# EAGLE design isd main lighting board-v2 (EAGLE 9.6.2)
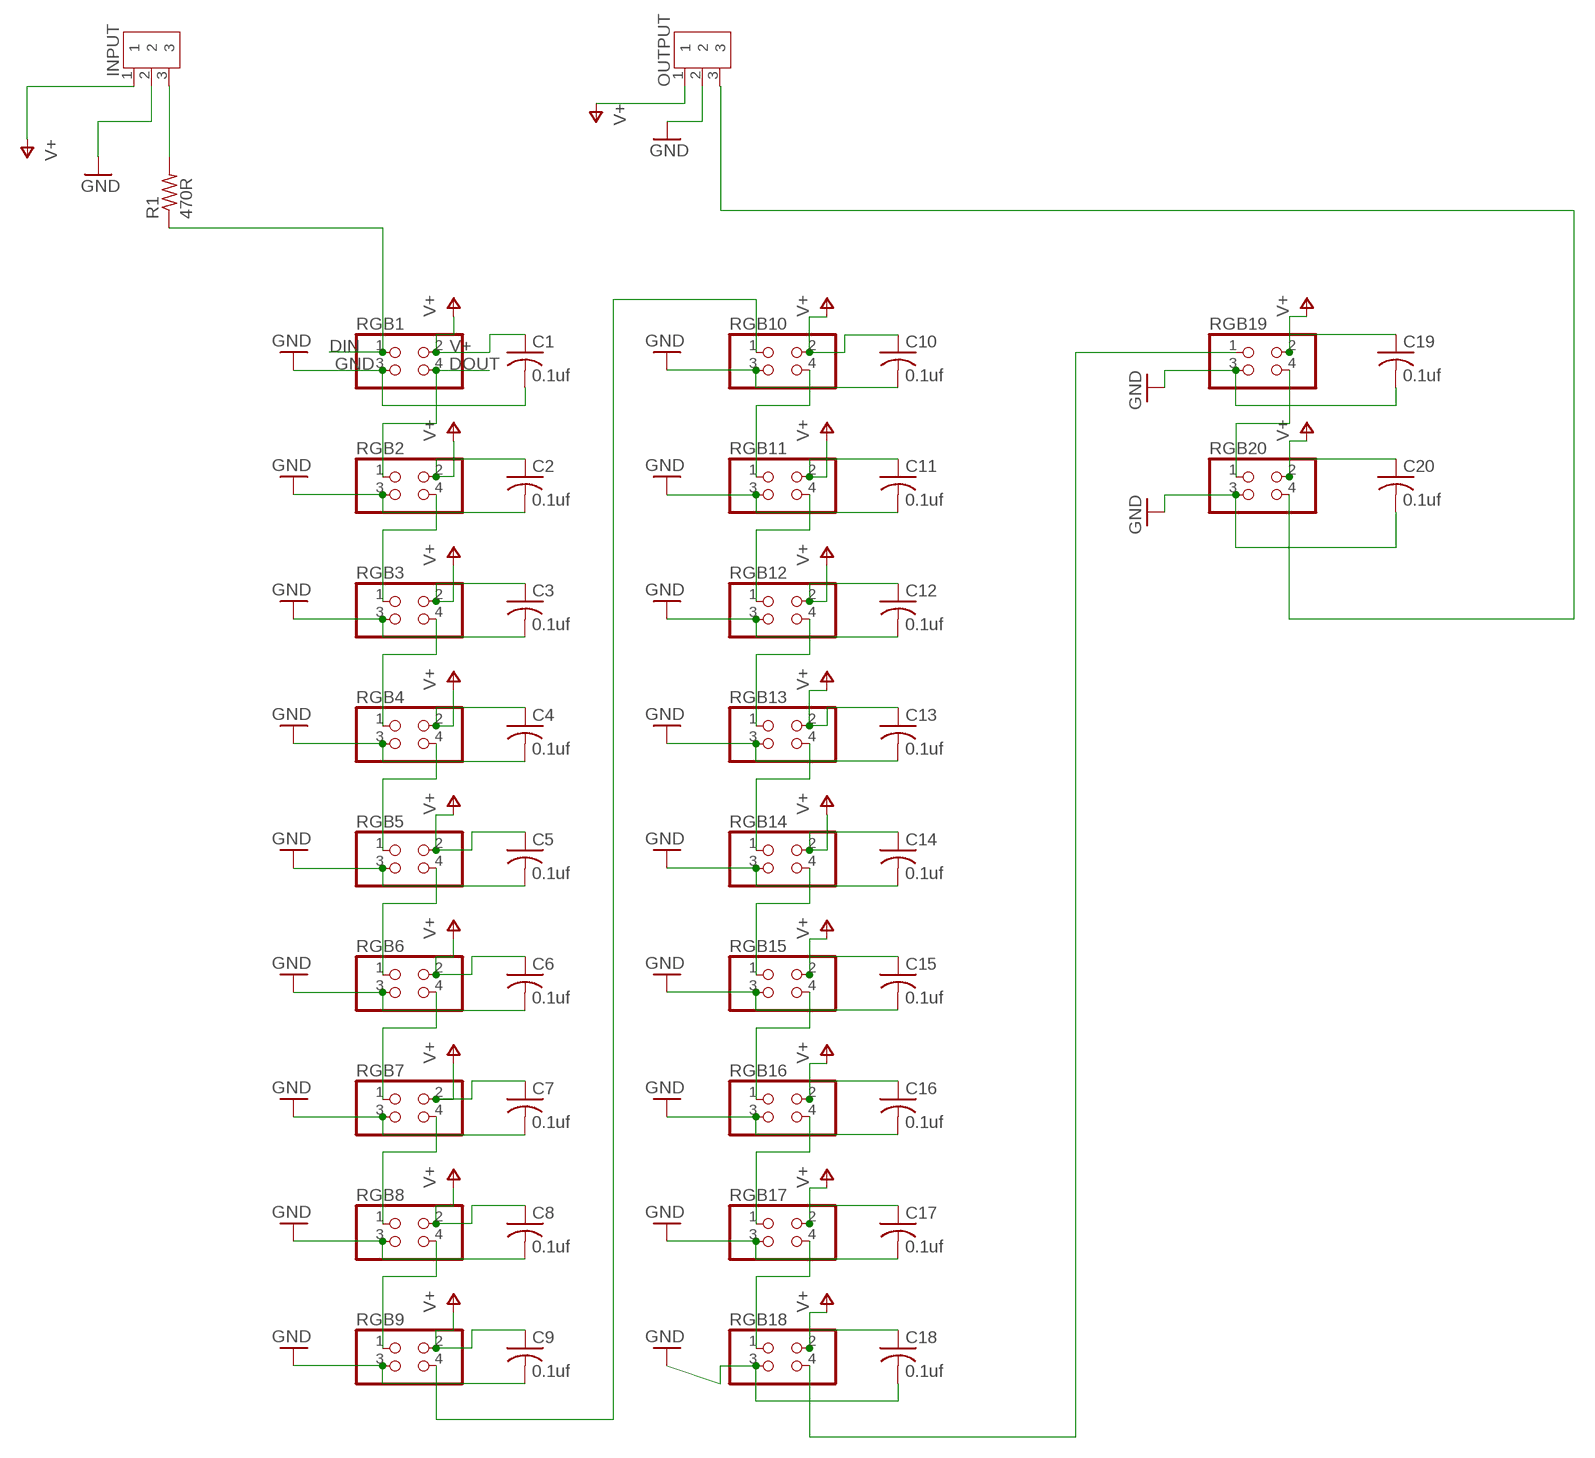
[diagram p0: schematic, sheet 1]

## Parts
C1  0.1uf  C-USC0805  [C0805]
C2  0.1uf  C-USC0805  [C0805]
C3  0.1uf  C-USC0805  [C0805]
C4  0.1uf  C-USC0805  [C0805]
C5  0.1uf  C-USC0805  [C0805]
C6  0.1uf  C-USC0805  [C0805]
C7  0.1uf  C-USC0805  [C0805]
C8  0.1uf  C-USC0805  [C0805]
C9  0.1uf  C-USC0805  [C0805]
C10  0.1uf  C-USC0805  [C0805]
C11  0.1uf  C-USC0805  [C0805]
C12  0.1uf  C-USC0805  [C0805]
C13  0.1uf  C-USC0805  [C0805]
C14  0.1uf  C-USC0805  [C0805]
C15  0.1uf  C-USC0805  [C0805]
C16  0.1uf  C-USC0805  [C0805]
C17  0.1uf  C-USC0805  [C0805]
C18  0.1uf  C-USC0805  [C0805]
C19  0.1uf  C-USC0805  [C0805]
C20  0.1uf  C-USC0805  [C0805]
INPUT  B3B-XH-A  [B3B-XH-A]
OUTPUT  B3B-XH-A  [B3B-XH-A]
R1  470R  R-US_0204/5  [0204/5]
RGB1  PINHD-2X2  [2X02]
RGB2  PINHD-2X2  [2X02]
RGB3  PINHD-2X2  [2X02]
RGB4  PINHD-2X2  [2X02]
RGB5  PINHD-2X2  [2X02]
RGB6  PINHD-2X2  [2X02]
RGB7  PINHD-2X2  [2X02]
RGB8  PINHD-2X2  [2X02]
RGB9  PINHD-2X2  [2X02]
RGB10  PINHD-2X2  [2X02]
RGB11  PINHD-2X2  [2X02]
RGB12  PINHD-2X2  [2X02]
RGB13  PINHD-2X2  [2X02]
RGB14  PINHD-2X2  [2X02]
RGB15  PINHD-2X2  [2X02]
RGB16  PINHD-2X2  [2X02]
RGB17  PINHD-2X2  [2X02]
RGB18  PINHD-2X2  [2X02]
RGB19  PINHD-2X2  [2X02]
RGB20  PINHD-2X2  [2X02]

## Nets
DIN: R1.1 RGB1.1
DOUT: RGB1.4 RGB2.1
GND: C1.2 C2.2 C3.2 C4.2 C5.2 C6.2 C7.2 C8.2 C9.2 C10.2 C11.2 C12.2 C13.2 C14.2 C15.2 C16.2 C17.2 C18.2 C19.2 C20.2 INPUT.2 OUTPUT.2 RGB1.3 RGB2.3 RGB3.3 RGB4.3 RGB5.3 RGB6.3 RGB7.3 RGB8.3 RGB9.3 RGB10.3 RGB11.3 RGB12.3 RGB13.3 RGB14.3 RGB15.3 RGB16.3 RGB17.3 RGB18.3 RGB19.3 RGB20.3
N$1: INPUT.3 R1.2
N$2: OUTPUT.3 RGB20.4
N$3: RGB18.4 RGB19.1
N$4: RGB8.4 RGB9.1
N$6: RGB16.4 RGB17.1
N$7: RGB19.4 RGB20.1
N$8: RGB15.4 RGB16.1
N$10: RGB14.4 RGB15.1
N$11: RGB17.4 RGB18.1
N$12: RGB13.4 RGB14.1
N$14: RGB12.4 RGB13.1
N$17: RGB11.4 RGB12.1
N$19: RGB10.4 RGB11.1
N$24: RGB9.4 RGB10.1
N$27: RGB7.4 RGB8.1
N$29: RGB6.4 RGB7.1
N$31: RGB5.4 RGB6.1
N$33: RGB4.4 RGB5.1
N$36: RGB3.4 RGB4.1
N$39: RGB2.4 RGB3.1
V+: C1.1 C2.1 C3.1 C4.1 C5.1 C6.1 C7.1 C8.1 C9.1 C10.1 C11.1 C12.1 C13.1 C14.1 C15.1 C16.1 C17.1 C18.1 C19.1 C20.1 INPUT.1 OUTPUT.1 RGB1.2 RGB2.2 RGB3.2 RGB4.2 RGB5.2 RGB6.2 RGB7.2 RGB8.2 RGB9.2 RGB10.2 RGB11.2 RGB12.2 RGB13.2 RGB14.2 RGB15.2 RGB16.2 RGB17.2 RGB18.2 RGB19.2 RGB20.2

## Library data of the parts
C1-C20 = adafruit:C-US: CAPACITOR, American symbol
INPUT OUTPUT = Connector:B3B-XH-A: XH Connector Top Entry - 3POS Details see: Datasheet <http://www.jst-mfg.com/product/pdf/eng/eXH.pdf>; CATEGORY: CONNECTOR; DESCRIPTION: 2.5mm pitch/disconnectable crimp style connector; MANUFACTURER: JST (XH connector); MPN: B3B-XH-A; PART_STATUS: ACTIVE; ROHS_COMPLIANT: COMPLIANT; SERIES: B3B-XH-A; SUB_CATEGORY: THROUGH HOLE CONNECTOR; TYPE: SIDE ENTRY; VALUE: 3A/250V
R1 = adafruit:R-US_: RESISTOR, American symbol
RGB1-RGB20 = pinhead:PINHD-2X2: PIN HEADER

## Net classes
0 default: clearance 0.205 mm

## Board
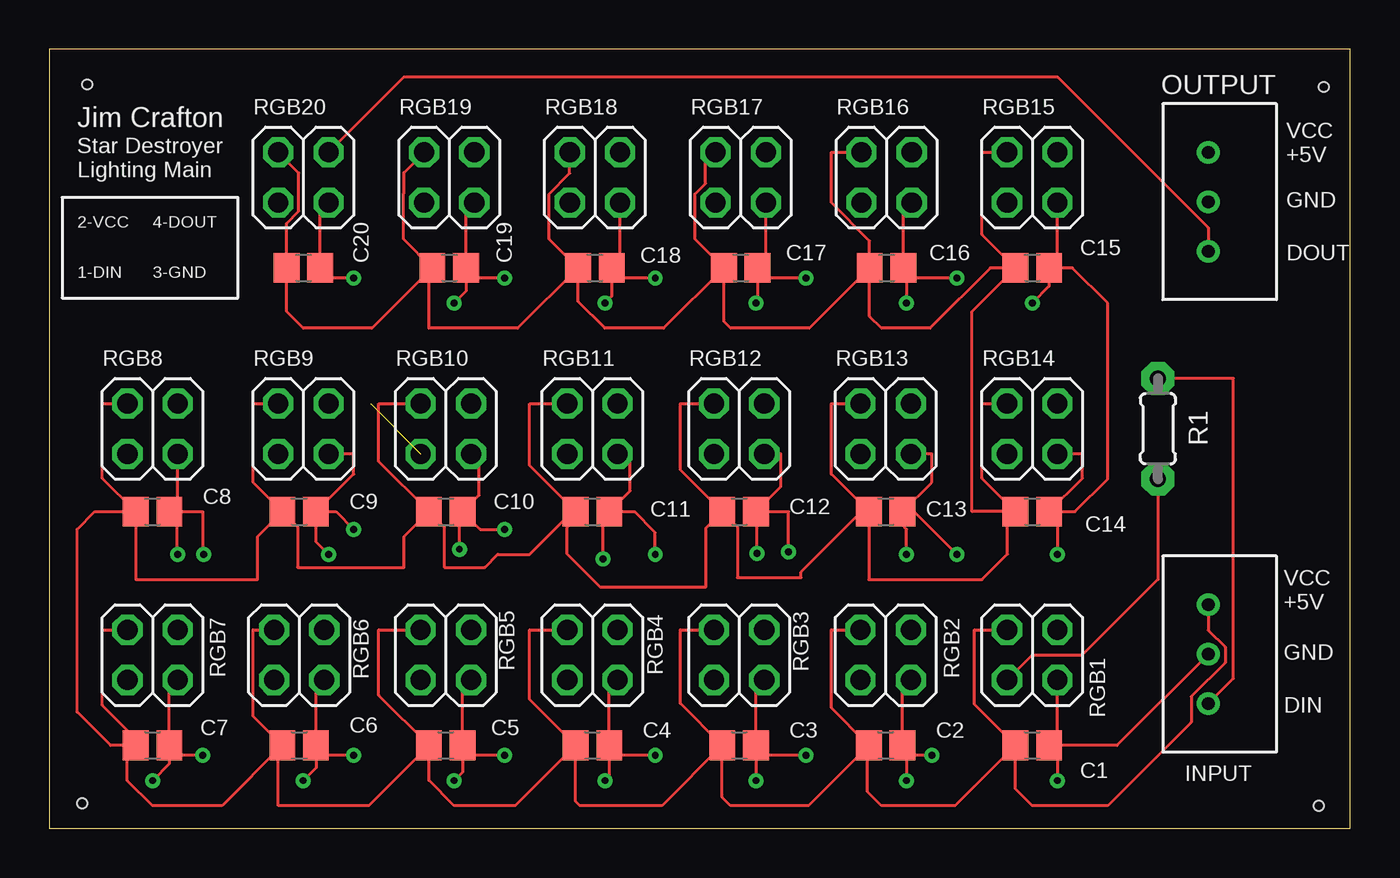
[diagram p1: board, top side]
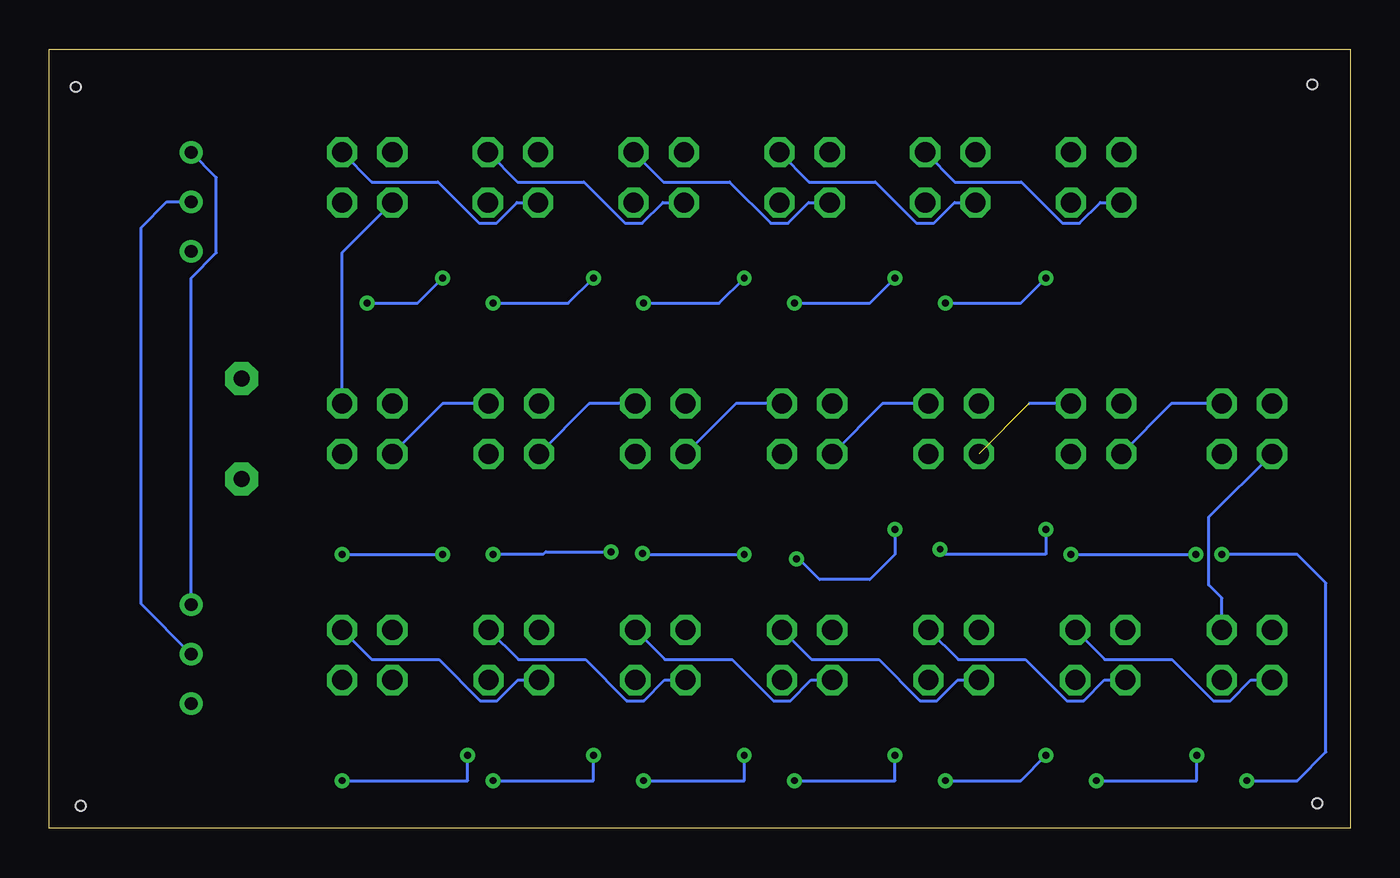
[diagram p2: board, bottom side, seen from below]

Size 65.71 x 39.36 mm. Coordinates in mm from the lower left corner, seen from the top.
Outline: 0,0 65.71,0 65.71,39.36 0,39.36 0,0
Copper layers (1*16): Top 0.035mm / dielectric 1.5mm / Bottom 0.035mm
Design rules "default": minimum track width 6mil, minimum drill 0.35mm, track to track 6mil, track to pad 6mil, pad to pad 6mil, via to via 6mil, smd to smd 6mil, copper to edge 40mil, drill to drill 6mil, minimum pad ring 10mil, minimum via ring 8mil, stop-mask expansion 4mil, vias tented up to drill 0mil, thermal gap 10mil
Holes 0.5 mm at 1.91,37.59 1.65,1.27 64.39,37.47 64.14,1.14

### Footprints (pad centres in the part's own frame; a part is rotated, then mirrored left to right if it is on the bottom)
C0805 = smd 1.3 x 1.5: 1 -0.85,0; 2 0.85,0
B3B-XH-A = drill 0.64: 1 0,0; 2 2.5,0; 3 5,0
0204/5 = drill 0.813 pad 1.676 octagon: 1 -2.54,0; 2 2.54,0
2X02 = drill 1.016 octagon: 1 -1.27,-1.27; 2 -1.27,1.27; 3 1.27,-1.27; 4 1.27,1.27

### Placement (x,y rotation side)
C1  49.66,4.19 0 top
C2  42.25,4.19 0 top
C3  34.84,4.19 0 top
C4  27.43,4.19 0 top
C5  20.02,4.19 0 top
C6  12.62,4.19 0 top
C7  5.21,4.19 0 top
C8  5.21,16 0 top
C9  12.62,16 0 top
C10  20.02,16 0 top
C11  27.43,16 0 top
C12  34.84,16 0 top
C13  42.25,16 0 top
C14  49.66,16 0 top
C15  49.66,28.32 0 top
C16  42.29,28.32 0 top
C17  34.92,28.32 0 top
C18  27.56,28.32 0 top
C19  20.19,28.32 0 top
C20  12.83,28.32 0 top
INPUT  58.55,11.3 270 top
OUTPUT  58.55,34.16 270 top
R1  56.01,20.19 90 top
RGB1  49.66,8.76 0 top
RGB2  42.25,8.76 0 top
RGB3  34.84,8.76 0 top
RGB4  27.43,8.76 0 top
RGB5  20.02,8.76 0 top
RGB6  12.62,8.76 0 top
RGB7  5.21,8.76 0 top
RGB8  5.21,20.19 0 top
RGB9  12.83,20.19 0 top
RGB10  20.02,20.19 0 top
RGB11  27.43,20.19 0 top
RGB12  34.84,20.19 0 top
RGB13  42.25,20.19 0 top
RGB14  49.66,20.19 0 top
RGB15  49.66,32.89 0 top
RGB16  42.29,32.89 0 top
RGB17  34.92,32.89 0 top
RGB18  27.56,32.89 0 top
RGB19  20.19,32.89 0 top
RGB20  12.83,32.89 0 top

### Tracks (layer width: path | path; a pad name or v marks a point on that pad's centre or on a via)
DIN
  Top 0.152: R1.1 56.01,12.57 52.17,8.74 49.63,8.74 RGB1.1
DOUT
  Bottom 0.152: RGB1.4 49.43,8.54 46.04,8.54 43.95,6.45 43.09,6.45 42.04,7.49 RGB2.1
GND  (via drill 0.35)
  Top 0.152: INPUT.2 53.94,4.19 C1.2 | C1.2 50.93,4.61 RGB1.3 | C2.2 43.1,7.07 RGB2.3 | C3.2 35.69,7.07 RGB3.3 | C4.2 28.28,7.07 RGB4.3 | C5.2 20.87,7.07 RGB5.3 | C6.2 13.46,7.07 RGB6.3 | C7.2 6.06,7.07 RGB7.3 | C14.2 52.2,17.69 52.2,18.92 RGB14.3 | C13.2 44.58,17.48 44.58,18.92 RGB13.3 | 35.74,16.05 C12.2 37.34,16 v37.34,13.97 | 35.74,16.05 36.96,17.27 36.96,18.92 RGB12.3 | C11.2 29.34,17.06 29.34,18.92 RGB11.3 | C10.2 21.72,16.84 21.72,18.92 RGB10.3 | C9.2 15.37,17.9 15.37,18.92 RGB9.3 | C8.2 6.46,15.6 6.46,13.86 v6.48,13.84 | C15.2 50.93,28.74 RGB15.3 | C16.2 43.14,31.2 RGB16.3 | C17.2 36.2,28.74 RGB17.3 | C18.2 28.83,28.74 RGB18.3 | C19.2 21.04,31.2 RGB19.3 | RGB20.3 13.68,31.2 C20.2 14.19,27.81 v15.37,27.81 | C1.2 50.93,3.77 v50.93,2.41 | v44.58,3.68 43.31,3.68 43.1,3.89 C2.2 | C2.2 43.31,3.98 v43.31,2.41 | v38.23,3.68 36.2,3.68 C3.2 | C3.2 v35.69,2.42 v35.69,2.41 | v30.61,3.68 28.79,3.68 C4.2 | C4.2 28.28,2.63 v28.07,2.41 | v22.99,3.68 21.38,3.68 C5.2 | C5.2 20.87,2.84 v20.45,2.41 | v15.37,3.68 13.97,3.68 C6.2 | C6.2 13.46,3.05 v12.83,2.41 | v7.75,3.68 6.57,3.68 C7.2 | C7.2 6.06,3.26 v5.21,2.41 | C9.2 14.1,16 | C8.2 7.75,16 7.75,13.84 v7.8,13.84 | v14.1,13.84 13.46,14.47 C9.2 | C9.2 14.48,16 v15.37,15.11 | v20.71,14.11 20.71,15.84 C10.2 | C10.2 21.76,15.11 v22.99,15.11 | v27.97,13.62 27.97,15.69 C11.2 | v30.61,13.84 30.61,14.95 29.55,16 C11.2 | v35.74,13.89 35.74,16.05 | v43.31,13.84 43.31,15.11 43.1,15.32 C13.2 | C15.2 50.51,27.39 v49.66,26.54 | v45.85,27.81 43.65,27.81 C16.2 | C16.2 43.31,28.16 v43.31,26.54 | v38.23,27.81 36.28,27.81 C17.2 | C17.2 35.77,26.63 v35.69,26.54 | v30.61,27.81 28.92,27.81 C18.2 | C18.2 28.41,26.89 v28.07,26.54
  Top 0.152: v22.99,27.81 21.55,27.81 C19.2 | C19.2 21.04,27.14 v20.45,26.54 | C8.2 6.48,16.42 RGB8.3 | C14.2 50.93,15.58 v50.93,13.84 | v45.85,13.84 43.69,16 C13.2 | C14.2 51.82,16 53.47,17.65 53.47,26.54 51.69,28.32 C15.2
  Bottom 0.152: v50.93,2.41 44.58,2.41 v44.58,3.68 | v43.31,2.41 38.23,2.41 v38.23,3.68 | v35.69,2.41 30.61,2.41 v30.61,3.68 | v28.07,2.41 22.99,2.41 v22.99,3.68 | v20.45,2.41 16.64,2.41 v15.37,3.68 | v12.83,2.41 7.75,2.41 v7.75,3.68 | v5.21,2.41 2.67,2.41 1.22,3.86 1.22,12.39 2.67,13.84 v6.48,13.84 | v14.1,13.84 v7.8,13.84 | v15.37,15.11 15.37,13.84 20.45,13.84 v20.71,14.11 | v22.99,15.11 22.99,13.84 24.26,12.57 26.8,12.57 27.91,13.68 v27.97,13.62 | v35.74,13.89 35.69,13.84 v30.61,13.84 | v43.31,13.84 40.77,13.84 40.64,13.97 v37.34,13.97 | INPUT.2 61.09,11.34 61.09,30.35 59.78,31.66 OUTPUT.2 | v49.66,26.54 47.12,26.54 v45.85,27.81 | v43.31,26.54 39.5,26.54 v38.23,27.81 | v35.69,26.54 31.88,26.54 v30.61,27.81 | v28.07,26.54 24.26,26.54 v22.99,27.81 | v20.45,26.54 16.64,26.54 v15.37,27.81 | v50.93,13.84 v45.85,13.84
N$1
  Top 0.152: INPUT.3 59.82,7.57 59.82,22.73 R1.2
N$2
  Top 0.152: RGB20.4 17.91,37.97 50.93,37.97 58.55,30.35 OUTPUT.3
N$3
  Bottom 0.152: RGB18.4 27.33,32.67 23.98,32.67 21.89,30.58 21.03,30.58 19.99,31.62 RGB19.1
N$4
  Bottom 0.152: RGB8.4 9.02,21.46 RGB9.1
N$6
  Bottom 0.152: RGB16.4 42.06,32.67 38.71,32.67 36.63,30.58 35.76,30.58 34.72,31.62 RGB17.1
N$7
  Bottom 0.152: RGB19.4 19.97,32.67 16.62,32.67 14.53,30.58 13.66,30.58 12.62,31.62 RGB20.1
N$8
  Bottom 0.152: RGB15.4 49.43,32.67 46.08,32.67 43.99,30.58 43.13,30.58 42.09,31.62 RGB16.1
N$10
  Bottom 0.152: RGB14.4 50.93,29.08 RGB15.1
N$11
  Bottom 0.152: RGB17.4 34.7,32.67 31.35,32.67 29.26,30.58 28.4,30.58 27.35,31.62 RGB18.1
N$12
  Bottom 0.152: RGB13.4 45.85,21.46 RGB14.1
N$14
  Bottom 0.152: RGB12.4 38.44,21.46 RGB13.1
N$17
  Bottom 0.152: RGB11.4 31.03,21.46 RGB12.1
N$19
  Bottom 0.152: RGB10.4 23.62,21.46 RGB11.1
N$24  (1 unrouted)
  Bottom 0.152: RGB9.4 16.21,21.46
N$27
  Bottom 0.152: RGB7.4 6.48,11.64 7.14,12.3 7.14,15.72 RGB8.1
N$29
  Bottom 0.152: RGB6.4 12.39,8.54 9,8.54 6.91,6.45 6.04,6.45 5,7.49 RGB7.1
N$31
  Bottom 0.152: RGB5.4 19.8,8.54 16.4,8.54 14.32,6.45 13.45,6.45 12.41,7.49 RGB6.1
N$33
  Bottom 0.152: RGB4.4 27.2,8.54 23.81,8.54 21.73,6.45 20.86,6.45 19.82,7.49 RGB5.1
N$36
  Bottom 0.152: RGB3.4 34.61,8.54 31.22,8.54 29.13,6.45 28.27,6.45 27.23,7.49 RGB4.1
N$39
  Bottom 0.152: RGB2.4 42.02,8.54 38.63,8.54 36.54,6.45 35.68,6.45 34.63,7.49 RGB3.1
V+
  Top 0.152: C1.1 46.74,6.26 46.74,10.03 RGB1.2 | C3.1 31.88,6.3 31.88,10.03 RGB3.2 | C4.1 24.26,6.52 24.26,10.03 RGB4.2 | C5.1 16.64,6.73 16.64,10.03 RGB5.2 | C6.1 10.29,5.67 10.29,10.03 RGB6.2 | C7.1 4.36,4.53 2.67,6.22 2.67,10.03 RGB7.2 | 41.34,4.25 C2.1 38.35,1.14 34.42,1.14 33.99,1.57 C3.1 | 41.34,4.25 39.5,6.09 39.5,10.03 RGB2.2 | C1.1 45.76,1.14 42.04,1.14 41.34,1.84 41.34,4.25 | C3.1 30.94,1.14 26.8,1.14 26.58,1.36 C4.1 | C4.1 23.53,1.14 20.45,1.14 19.17,2.42 C5.1 | C5.1 16.13,1.14 11.56,1.14 11.56,3.98 C6.1 | C7.1 3.94,4.19 3.94,2.41 5.21,1.14 8.72,1.14 C6.1 | C9.1 11.32,15.55 | C8.1 2.67,17.69 2.67,21.46 RGB8.2 | C9.1 10.29,17.48 10.29,21.46 RGB9.2 | C10.1 16.64,18.54 16.64,21.46 RGB10.2 | 26.5,16.09 C11.1 26.58,15.63 26.13,15.18 26.13,13.89 27.83,12.19 33.15,12.19 33.15,15.16 C12.1 | 26.5,16.09 24.26,18.33 24.26,21.46 RGB11.2 | C12.1 31.88,18.11 31.88,21.46 RGB12.2 | C13.1 39.5,17.9 39.5,21.46 RGB13.2 | 48.41,16.4 C14.1 46.61,16 46.61,26.12 C15.1 | 48.41,16.4 47.12,17.69 47.12,21.46 RGB14.2 | C12.1 33.54,15.55 | C15.1 47.54,28.32 44.49,25.27 42.04,25.27 41.44,25.87 C16.1 | C16.1 38.39,25.27 34.42,25.27 34.08,25.61 C17.1 | C17.1 31.03,25.27 28.07,25.27 26.71,26.63 C18.1 | C18.1 23.66,25.27 19.18,25.27 19.18,28.16 C19.1 | C19.1 16.3,25.27 12.83,25.27 11.98,26.12 C20.1 11.98,30.57 12.6,31.19 12.6,33.12 RGB20.2 | C15.1 47.12,30.01 47.12,34.16 RGB15.2 | C16.1 41.44,29.68 39.5,31.62 39.5,34.16 RGB16.2 | C17.1 32.61,29.78 32.61,32.05 33.15,32.59 33.15,34.16 RGB17.2 | RGB18.2 26.29,33.1 25.25,32.05 25.25,29.78 C18.1 | C19.1 17.88,29.78 17.88,32.05 17.91,32.08 17.91,33.15 RGB19.2 | INPUT.1 58.55,10.01 59.4,9.16 59.4,8.37 57.69,6.66 57.69,5.37 53.47,1.14 49.66,1.14 48.81,1.99 C1.1
  Top 0.152: C7.1 3.09,4.19 1.4,5.88 1.4,15.11 2.29,16 C8.1 | C8.1 4.36,12.57 10.49,12.57 10.49,14.73 C9.1 | C9.1 12.53,15.23 12.53,13.2 12.55,13.18 17.9,13.18 17.9,14.73 C10.1 | C10.1 19.94,15.23 19.94,13.19 22,13.19 22.65,13.84 24.26,13.84 26.5,16.09 | C12.1 34.76,15.23 34.76,12.68 37.97,12.68 37.97,12.96 41.02,16 C13.1 | C13.1 41.4,12.57 47.12,12.57 48.41,13.86 48.41,16.4
  Bottom 0.152: INPUT.1 58.55,27.81 57.28,29.08 57.28,32.89 OUTPUT.1

### Text on the board
tPlace: Jim Crafton | VCC / +5V | Star Destroyer / Lighting Main | GND | 2-VCC | 4-DOUT | DOUT | 1-DIN | 3-GND | VCC / +5V | GND | DIN